# EasyEDA Pro project MayKhoan.eprj

# Schematic Schematic1
Create Date: 2024-08-09; Page Name: P1; Project Name: MayKhoan; Schematic Name: Schematic1; Update Date: 2024-08-12; Company: EasyEDA.com; Drawn: EasyEDA; Page Size: A4; Part Number: JLCPCB-002; Reviewed: EasyEDA; Version: V0.1
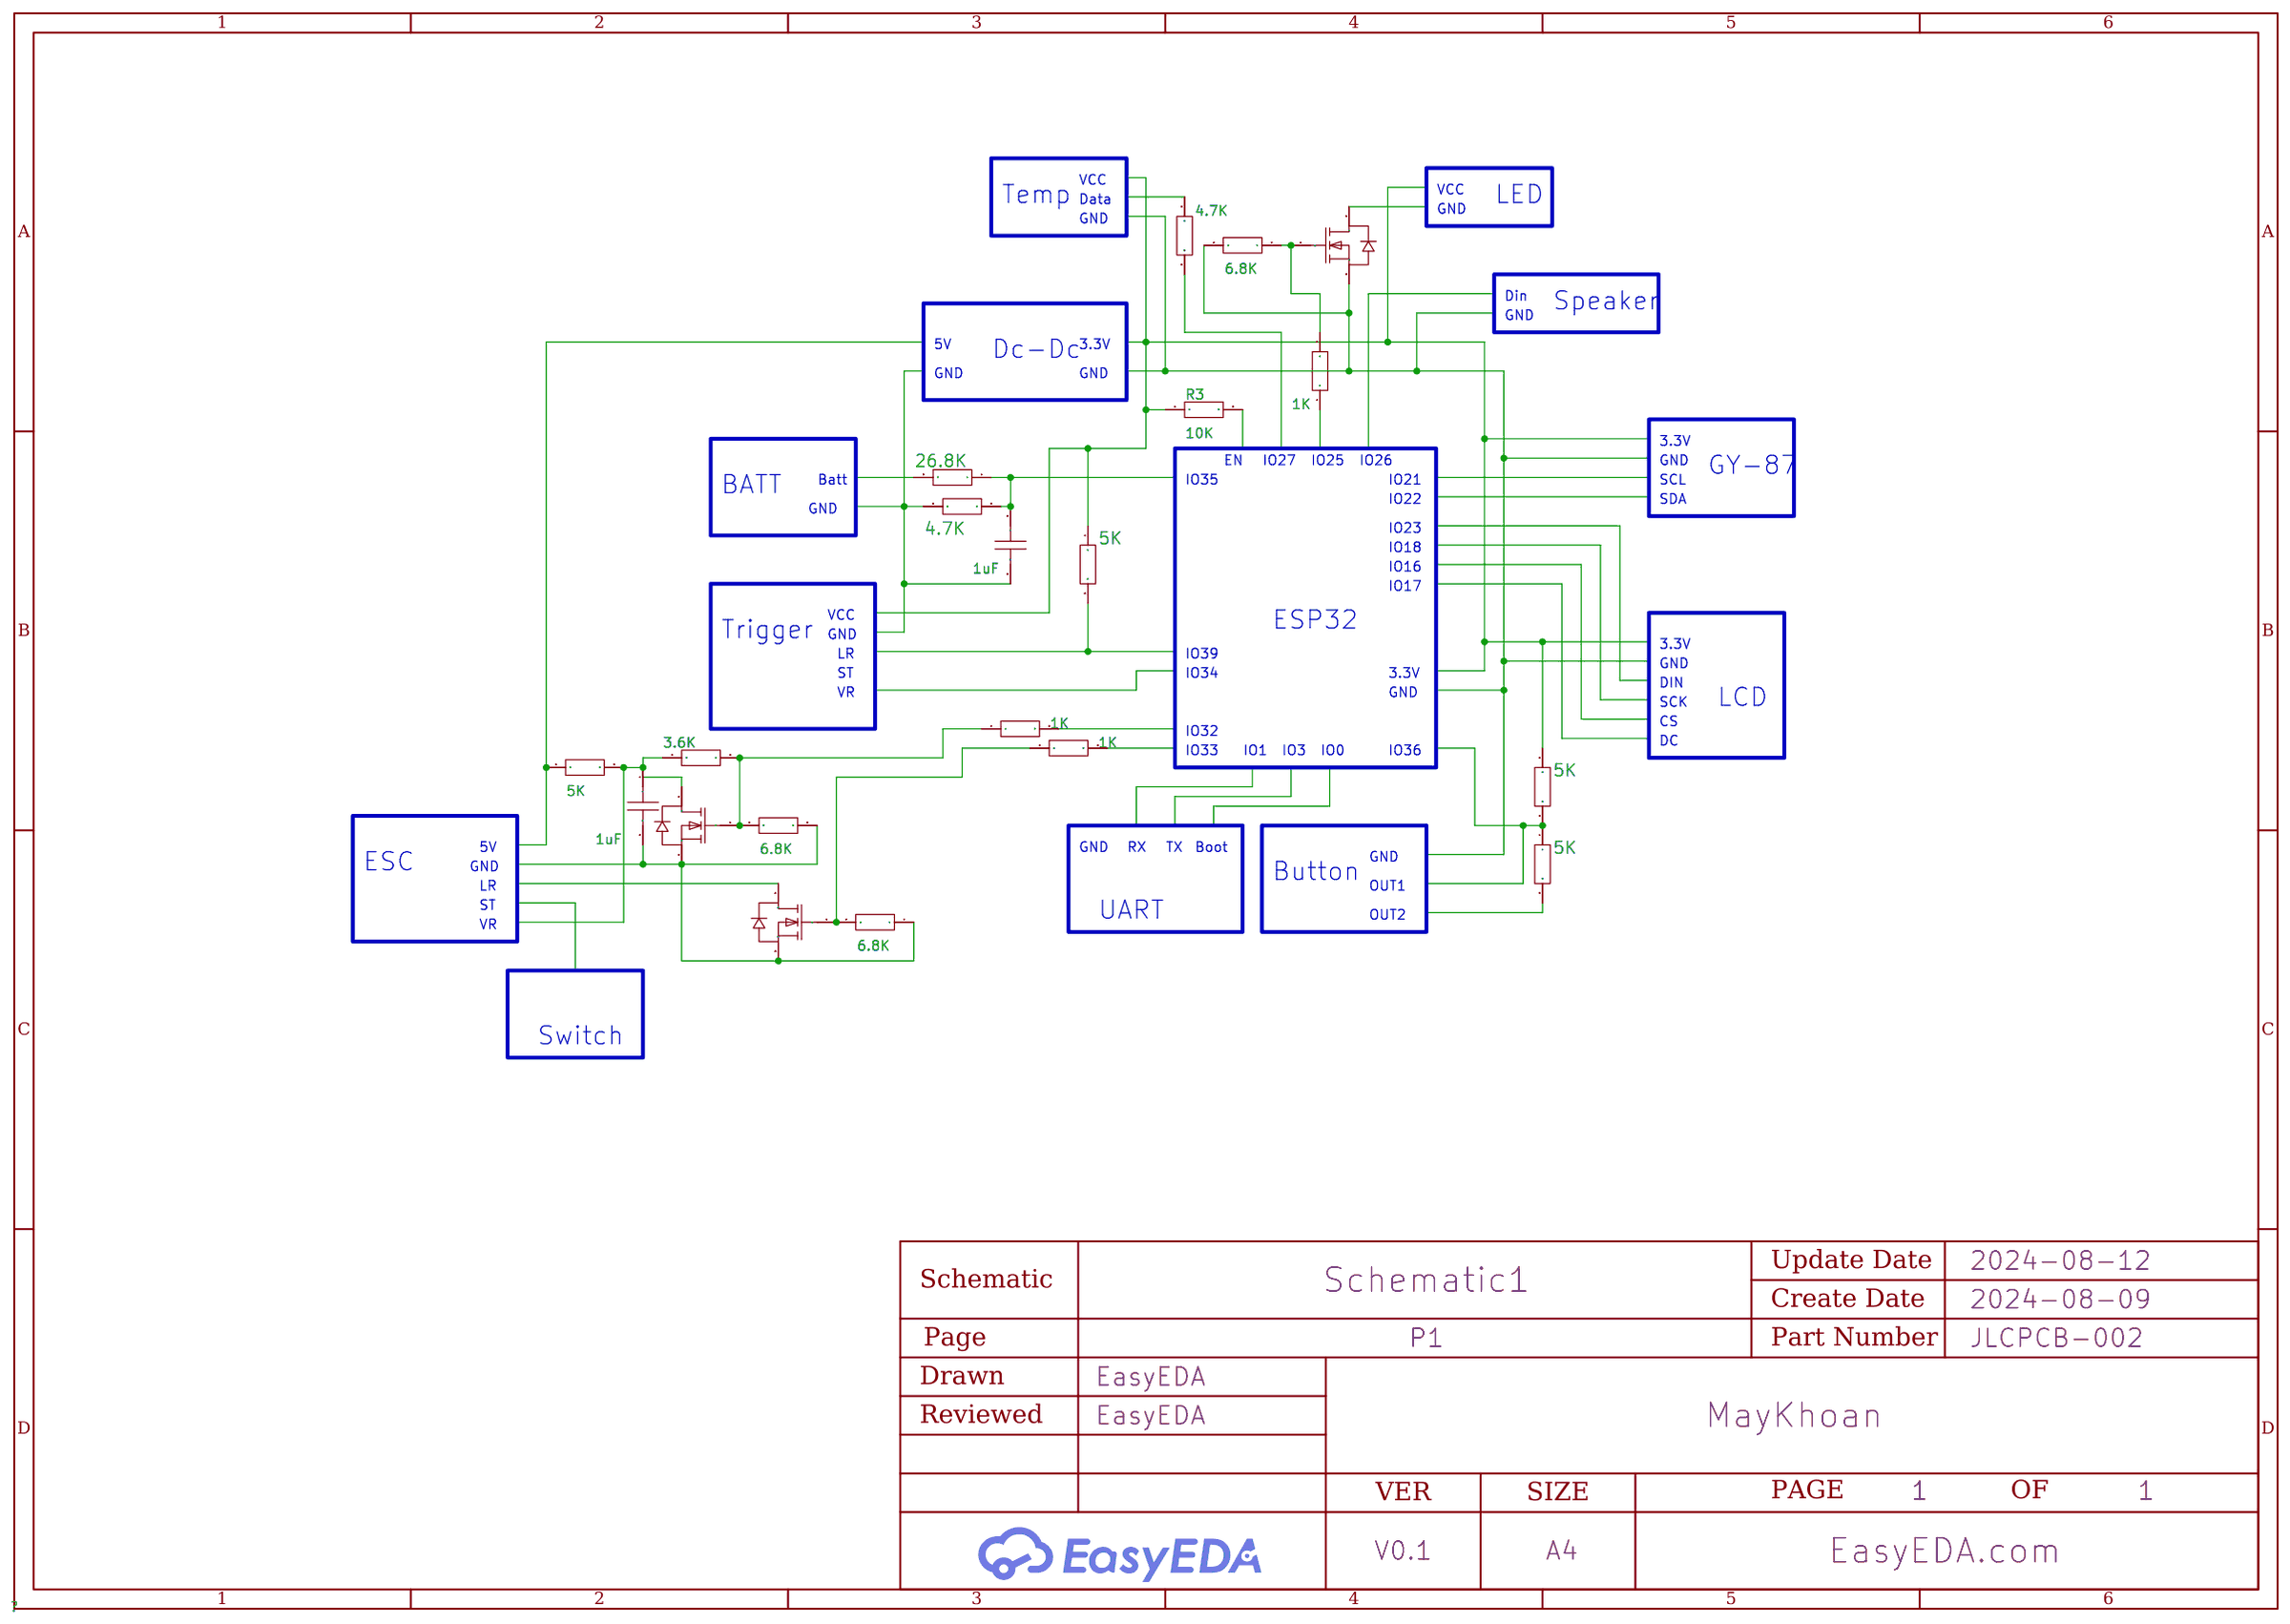
[diagram p0: schematic sheet]

## Parts
C1  1uF  [C0603]
C2  1uF  [C0603]
R1  4.7K  [R0603]
R2  26.8K  [R0603]
R3  10K  [R0603]
R4  5K  [R0603]
R5  3.6K  [R0603]
R6  5K  [R0603]
R7  6.8K  [R0603]
R8  6.8K  [R0603]
R10  5K  [R0603]
R11  5K  [R0603]
R12  6.8K  [R0603]
R14  1K  [R0603]
R15  1K  [R0603]
R16  1K  [R0603]
R17  4.7K  [R0603]
U1  GC2M0080120D  [TO-247-3_L15.8-W5.0-P5.44-L]
U2  GC2M0080120D  [TO-247-3_L15.8-W5.0-P5.44-L]
U4  GC2M0080120D  [TO-247-3_L15.8-W5.0-P5.44-L]

## Library data of the parts
C1 C2 = CAP_0603: Supplier Footprint: 0603
R1-R8 R10-R12 R14-R17 = Res_0603: Supplier Footprint: 0603
U1 U2 U4 = GC2M0080120D: Supplier Part: C7435046; Manufacturer: SUPSiC(国晶微半导体); Supplier Footprint: TO247-3; JLCPCB Part Class: Extended Part; Datasheet: https://atta.szlcsc.com/upload/public/pdf/source/20230905/1E5F623CE25FF8D8A2471F405B0325BA.pdf; Supplier: LCSC

## Nets
Net-(C1-1): C1.1 R5.1 R6.2 U2.2(D)
Net-(C1-2): C1.2 R7.1 R8.1 U1.3(S) U2.3(S)
Net-(C2-1): C2.1 R1.1 R2.1
Net-(C2-2): C2.2 R1.2
Net-(R3-1): R3.1 R4.1 R11.1
Net-(R5-2): R5.2 R7.2 R15.1 U2.1(G)
Net-(R8-2): R8.2 R14.1 U1.1(G)
Net-(R10-1): R10.1 R11.2
Net-(R12-1): R12.1 R16.2 U4.1(G)
Net-(R12-2): R12.2 U4.3(S)

Not connected (* = marked no-connect by the designer): R2 2; R3 2; R4 2; R6 1; R10 2; R14 2; R15 2; R16 1; R17 1 2; U1 2(D); U4 2(D)

## Notes on the sheet
- Temp
- Data
- VCC
- VCC
- LED
- GND
- GND
- Din
- Speaker
- GND
- 5V
- Dc-Dc
- 3.3V
- GND
- GND
- 3.3V
- EN
- IO27
- IO25
- IO26
- GND
- GY-87
- BATT
- Batt
- IO35
- IO21
- SCL
- GND
- IO22
- SDA
- IO23
- IO18
- IO16
- IO17
- VCC
- ESP32
- Trigger
- GND
- LR
- IO39
- 3.3V
- ST
- IO34
- 3.3V
- GND
- VR
- GND
- DIN
- SCK
- LCD
- CS
- IO32
- DC
- IO33
- IO1
- IO3
- IO0
- IO36
- 5V
- GND
- RX
- TX
- Boot
- GND
- ESC
- GND
- Button
- LR
- ST
- OUT1
- VR
- UART
- OUT2
- Switch
